# EasyEDA Pro project Soruce.epro, schematic Schematic1

## Sheets
1 P1: Board Name: Board1; Create Date: 2026-04-02; Page Name: P1; Project Name: LED MATRIX; Schematic Name: Schematic1; Update Date: 2026-04-02; Company: EasyEDA.com; Page Size: A4; Version: V1.0
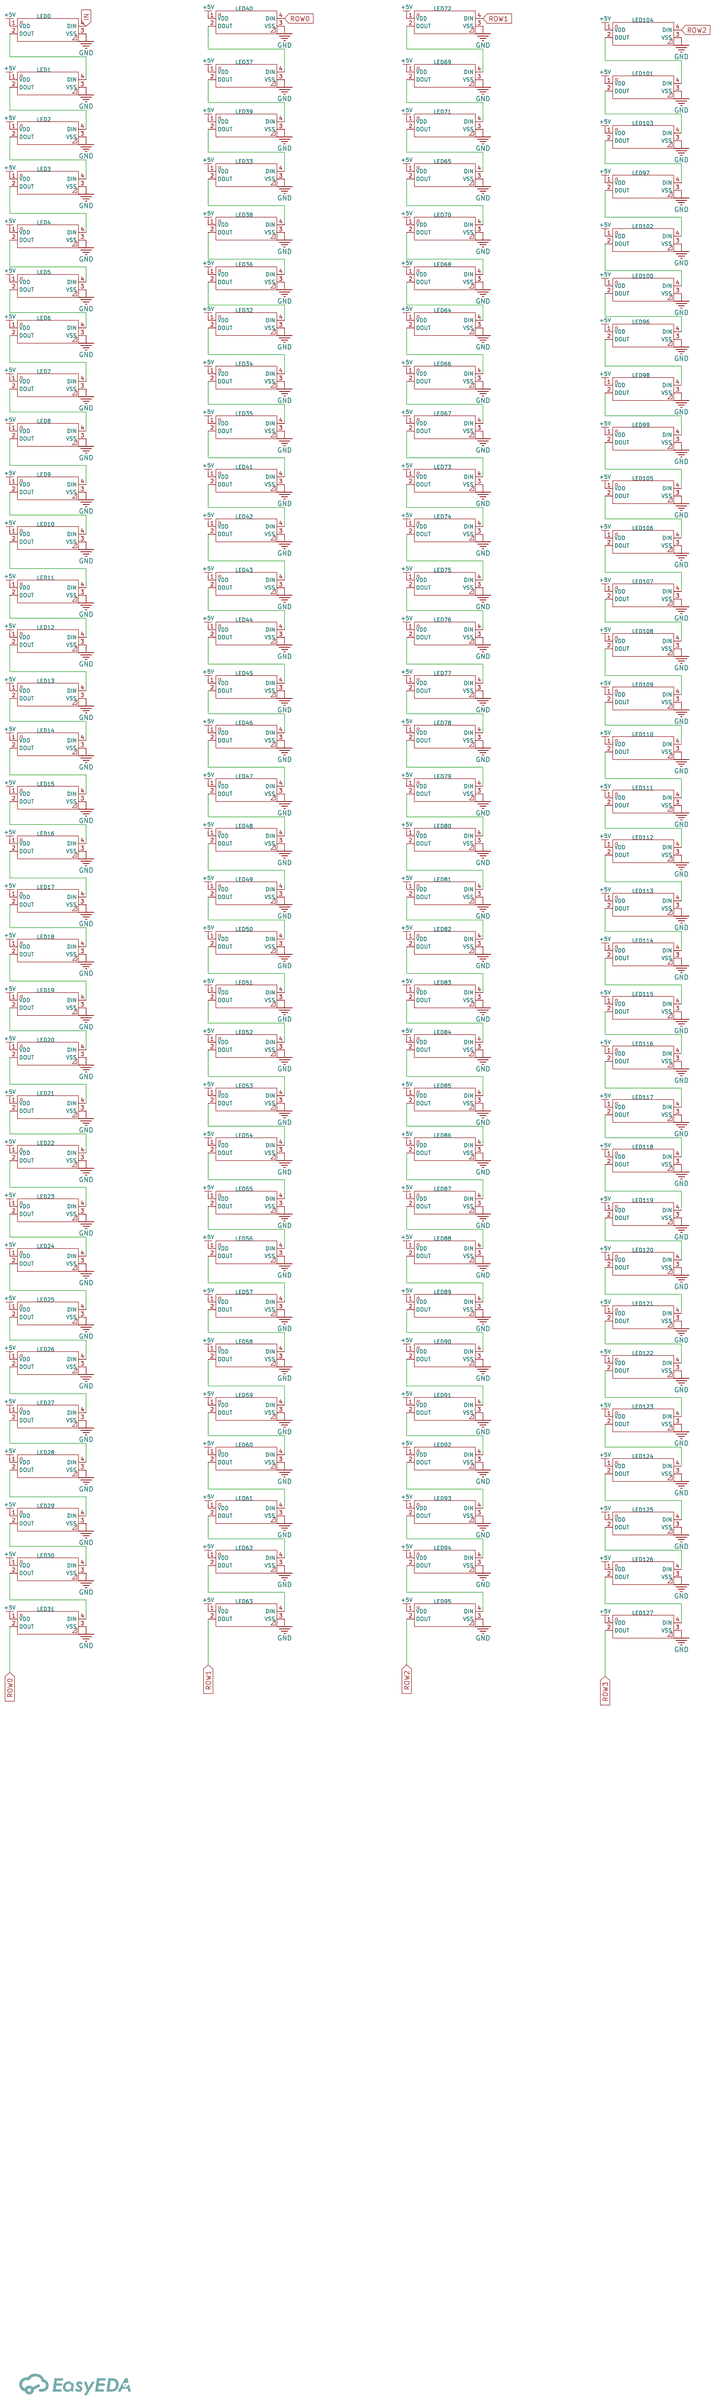
[diagram p0: P1]
2 P2: Page Name: P2
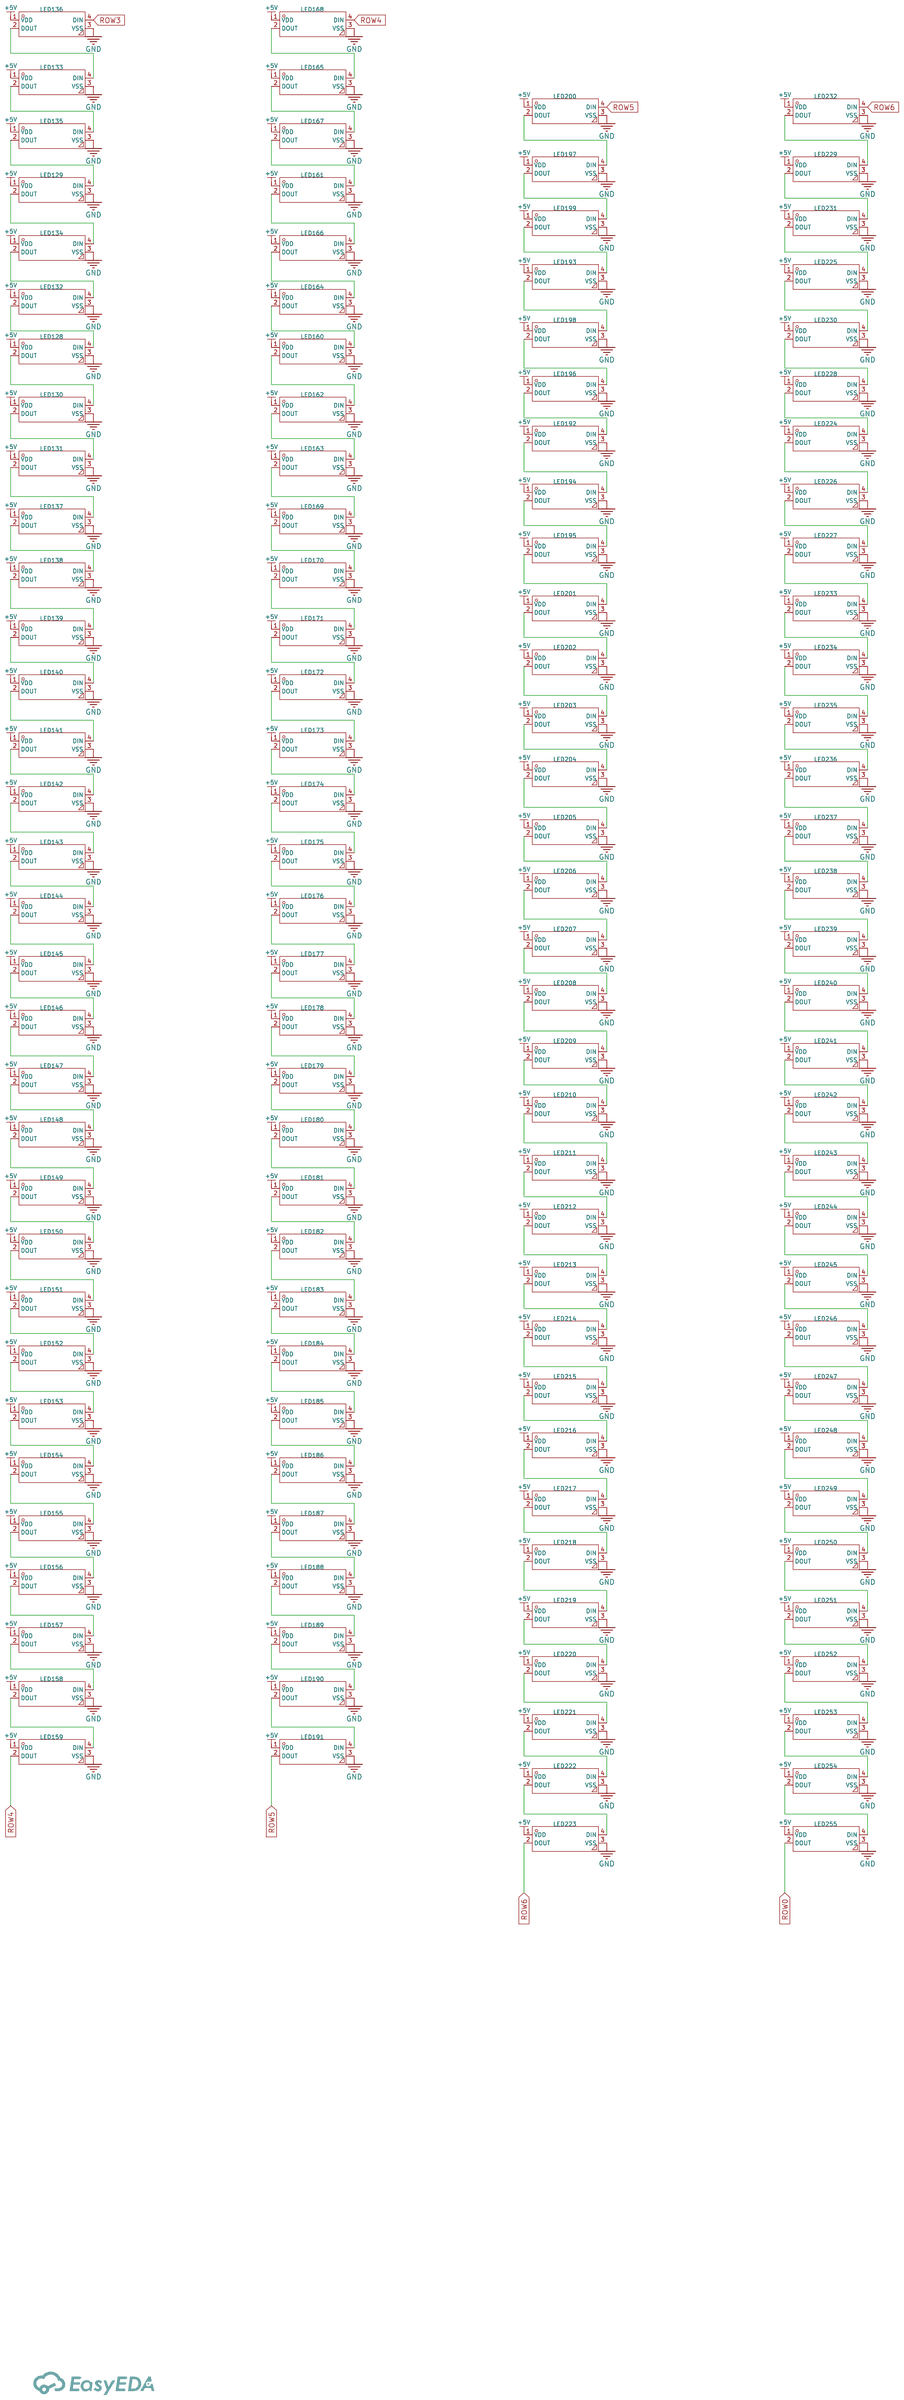
[diagram p1: P2]
3 P3: Page Name: P3
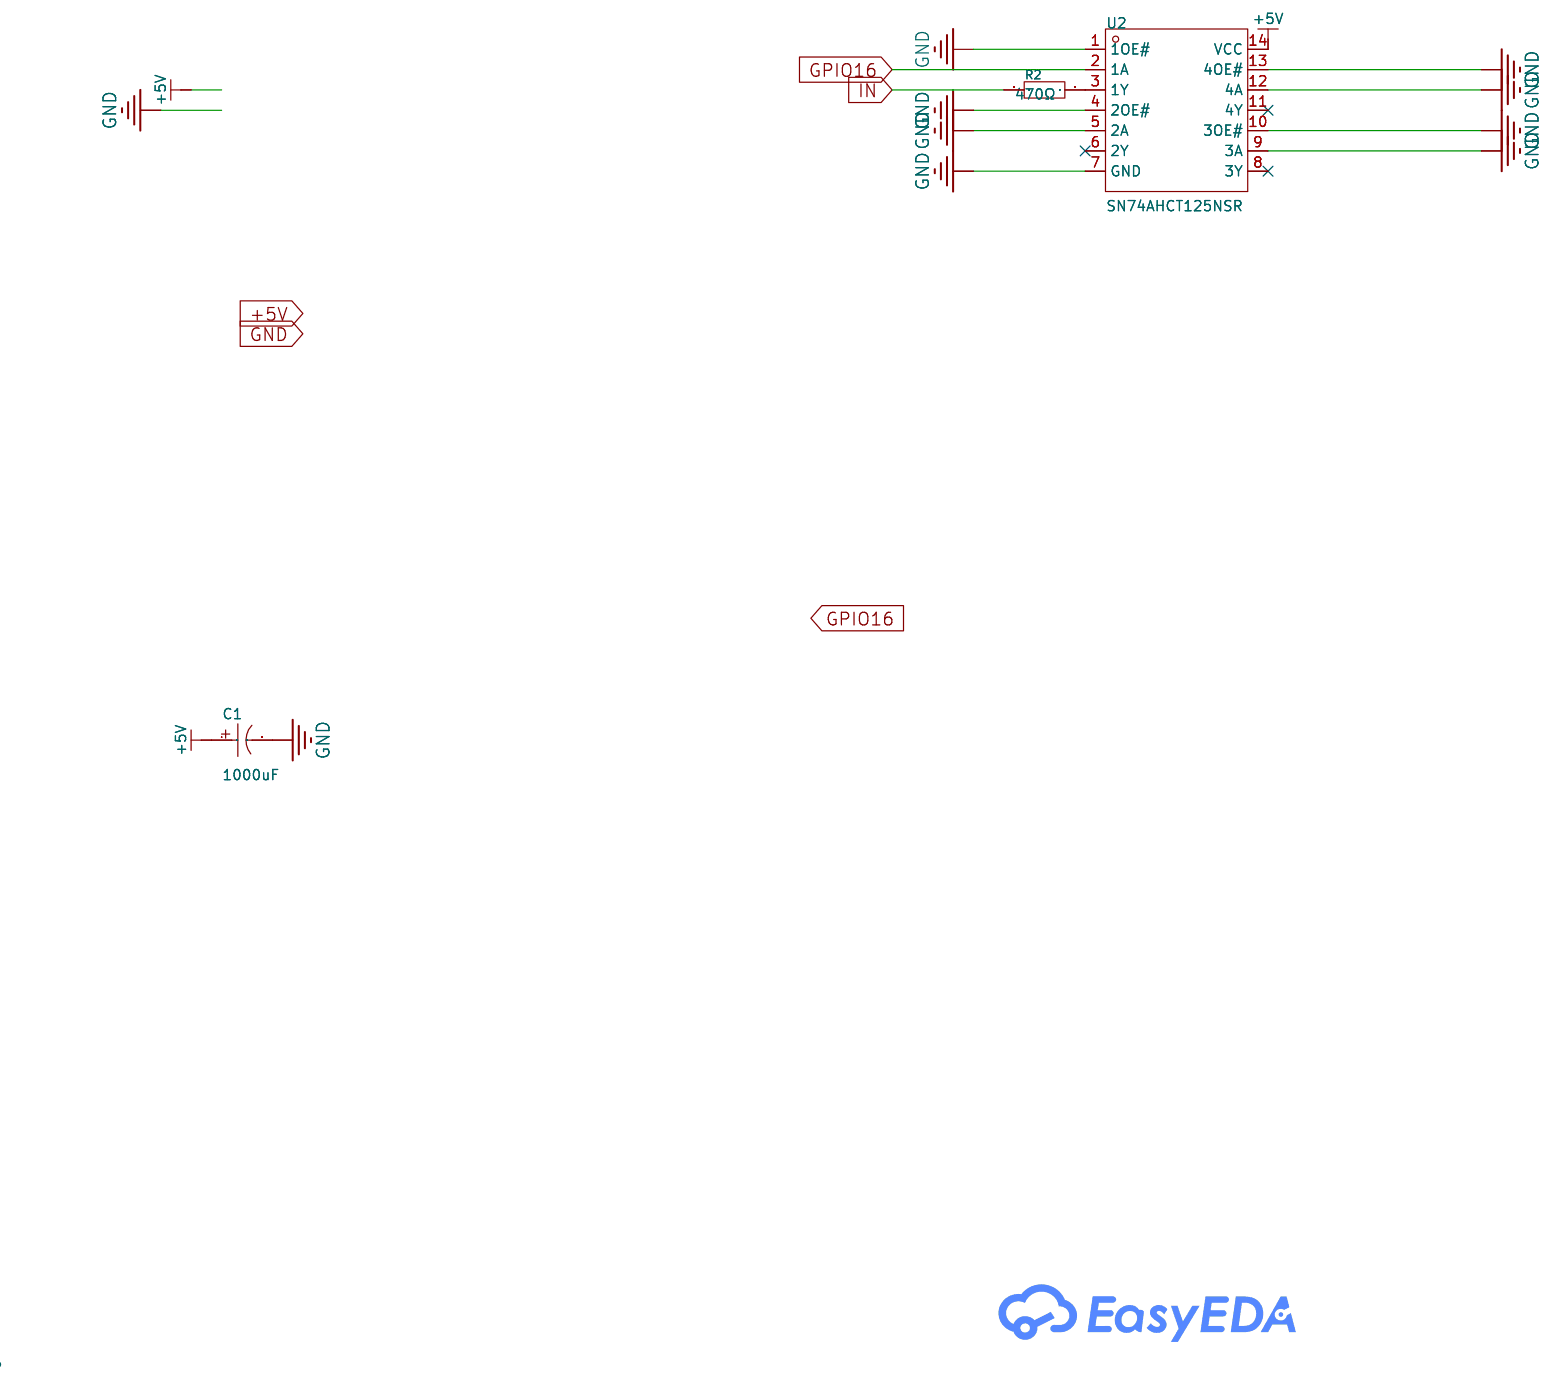
[diagram p2: P3]

## Parts
sheet P1
LED0  WS2812B-B/T  [LED-SMD_4P-L5.0-W5.0-TL_WS2812B-B]
LED1  WS2812B-B/T  [LED-SMD_4P-L5.0-W5.0-TL_WS2812B-B]
LED2  WS2812B-B/T  [LED-SMD_4P-L5.0-W5.0-TL_WS2812B-B]
LED3  WS2812B-B/T  [LED-SMD_4P-L5.0-W5.0-TL_WS2812B-B]
LED4  WS2812B-B/T  [LED-SMD_4P-L5.0-W5.0-TL_WS2812B-B]
LED5  WS2812B-B/T  [LED-SMD_4P-L5.0-W5.0-TL_WS2812B-B]
LED6  WS2812B-B/T  [LED-SMD_4P-L5.0-W5.0-TL_WS2812B-B]
LED7  WS2812B-B/T  [LED-SMD_4P-L5.0-W5.0-TL_WS2812B-B]
LED8  WS2812B-B/T  [LED-SMD_4P-L5.0-W5.0-TL_WS2812B-B]
LED9  WS2812B-B/T  [LED-SMD_4P-L5.0-W5.0-TL_WS2812B-B]
LED10  WS2812B-B/T  [LED-SMD_4P-L5.0-W5.0-TL_WS2812B-B]
LED11  WS2812B-B/T  [LED-SMD_4P-L5.0-W5.0-TL_WS2812B-B]
LED12  WS2812B-B/T  [LED-SMD_4P-L5.0-W5.0-TL_WS2812B-B]
LED13  WS2812B-B/T  [LED-SMD_4P-L5.0-W5.0-TL_WS2812B-B]
LED14  WS2812B-B/T  [LED-SMD_4P-L5.0-W5.0-TL_WS2812B-B]
LED15  WS2812B-B/T  [LED-SMD_4P-L5.0-W5.0-TL_WS2812B-B]
LED16  WS2812B-B/T  [LED-SMD_4P-L5.0-W5.0-TL_WS2812B-B]
LED17  WS2812B-B/T  [LED-SMD_4P-L5.0-W5.0-TL_WS2812B-B]
LED18  WS2812B-B/T  [LED-SMD_4P-L5.0-W5.0-TL_WS2812B-B]
LED19  WS2812B-B/T  [LED-SMD_4P-L5.0-W5.0-TL_WS2812B-B]
LED20  WS2812B-B/T  [LED-SMD_4P-L5.0-W5.0-TL_WS2812B-B]
LED21  WS2812B-B/T  [LED-SMD_4P-L5.0-W5.0-TL_WS2812B-B]
LED22  WS2812B-B/T  [LED-SMD_4P-L5.0-W5.0-TL_WS2812B-B]
LED23  WS2812B-B/T  [LED-SMD_4P-L5.0-W5.0-TL_WS2812B-B]
LED24  WS2812B-B/T  [LED-SMD_4P-L5.0-W5.0-TL_WS2812B-B]
LED25  WS2812B-B/T  [LED-SMD_4P-L5.0-W5.0-TL_WS2812B-B]
LED26  WS2812B-B/T  [LED-SMD_4P-L5.0-W5.0-TL_WS2812B-B]
LED27  WS2812B-B/T  [LED-SMD_4P-L5.0-W5.0-TL_WS2812B-B]
LED28  WS2812B-B/T  [LED-SMD_4P-L5.0-W5.0-TL_WS2812B-B]
LED29  WS2812B-B/T  [LED-SMD_4P-L5.0-W5.0-TL_WS2812B-B]
LED30  WS2812B-B/T  [LED-SMD_4P-L5.0-W5.0-TL_WS2812B-B]
LED31  WS2812B-B/T  [LED-SMD_4P-L5.0-W5.0-TL_WS2812B-B]
LED32  WS2812B-B/T  [LED-SMD_4P-L5.0-W5.0-TL_WS2812B-B]
LED33  WS2812B-B/T  [LED-SMD_4P-L5.0-W5.0-TL_WS2812B-B]
LED34  WS2812B-B/T  [LED-SMD_4P-L5.0-W5.0-TL_WS2812B-B]
LED35  WS2812B-B/T  [LED-SMD_4P-L5.0-W5.0-TL_WS2812B-B]
LED36  WS2812B-B/T  [LED-SMD_4P-L5.0-W5.0-TL_WS2812B-B]
LED37  WS2812B-B/T  [LED-SMD_4P-L5.0-W5.0-TL_WS2812B-B]
LED38  WS2812B-B/T  [LED-SMD_4P-L5.0-W5.0-TL_WS2812B-B]
LED39  WS2812B-B/T  [LED-SMD_4P-L5.0-W5.0-TL_WS2812B-B]
LED40  WS2812B-B/T  [LED-SMD_4P-L5.0-W5.0-TL_WS2812B-B]
LED41  WS2812B-B/T  [LED-SMD_4P-L5.0-W5.0-TL_WS2812B-B]
LED42  WS2812B-B/T  [LED-SMD_4P-L5.0-W5.0-TL_WS2812B-B]
LED43  WS2812B-B/T  [LED-SMD_4P-L5.0-W5.0-TL_WS2812B-B]
LED44  WS2812B-B/T  [LED-SMD_4P-L5.0-W5.0-TL_WS2812B-B]
LED45  WS2812B-B/T  [LED-SMD_4P-L5.0-W5.0-TL_WS2812B-B]
LED46  WS2812B-B/T  [LED-SMD_4P-L5.0-W5.0-TL_WS2812B-B]
LED47  WS2812B-B/T  [LED-SMD_4P-L5.0-W5.0-TL_WS2812B-B]
LED48  WS2812B-B/T  [LED-SMD_4P-L5.0-W5.0-TL_WS2812B-B]
LED49  WS2812B-B/T  [LED-SMD_4P-L5.0-W5.0-TL_WS2812B-B]
LED50  WS2812B-B/T  [LED-SMD_4P-L5.0-W5.0-TL_WS2812B-B]
LED51  WS2812B-B/T  [LED-SMD_4P-L5.0-W5.0-TL_WS2812B-B]
LED52  WS2812B-B/T  [LED-SMD_4P-L5.0-W5.0-TL_WS2812B-B]
LED53  WS2812B-B/T  [LED-SMD_4P-L5.0-W5.0-TL_WS2812B-B]
LED54  WS2812B-B/T  [LED-SMD_4P-L5.0-W5.0-TL_WS2812B-B]
LED55  WS2812B-B/T  [LED-SMD_4P-L5.0-W5.0-TL_WS2812B-B]
LED56  WS2812B-B/T  [LED-SMD_4P-L5.0-W5.0-TL_WS2812B-B]
LED57  WS2812B-B/T  [LED-SMD_4P-L5.0-W5.0-TL_WS2812B-B]
LED58  WS2812B-B/T  [LED-SMD_4P-L5.0-W5.0-TL_WS2812B-B]
LED59  WS2812B-B/T  [LED-SMD_4P-L5.0-W5.0-TL_WS2812B-B]
LED60  WS2812B-B/T  [LED-SMD_4P-L5.0-W5.0-TL_WS2812B-B]
LED61  WS2812B-B/T  [LED-SMD_4P-L5.0-W5.0-TL_WS2812B-B]
LED62  WS2812B-B/T  [LED-SMD_4P-L5.0-W5.0-TL_WS2812B-B]
LED63  WS2812B-B/T  [LED-SMD_4P-L5.0-W5.0-TL_WS2812B-B]
LED64  WS2812B-B/T  [LED-SMD_4P-L5.0-W5.0-TL_WS2812B-B]
LED65  WS2812B-B/T  [LED-SMD_4P-L5.0-W5.0-TL_WS2812B-B]
LED66  WS2812B-B/T  [LED-SMD_4P-L5.0-W5.0-TL_WS2812B-B]
LED67  WS2812B-B/T  [LED-SMD_4P-L5.0-W5.0-TL_WS2812B-B]
LED68  WS2812B-B/T  [LED-SMD_4P-L5.0-W5.0-TL_WS2812B-B]
LED69  WS2812B-B/T  [LED-SMD_4P-L5.0-W5.0-TL_WS2812B-B]
LED70  WS2812B-B/T  [LED-SMD_4P-L5.0-W5.0-TL_WS2812B-B]
LED71  WS2812B-B/T  [LED-SMD_4P-L5.0-W5.0-TL_WS2812B-B]
LED72  WS2812B-B/T  [LED-SMD_4P-L5.0-W5.0-TL_WS2812B-B]
LED73  WS2812B-B/T  [LED-SMD_4P-L5.0-W5.0-TL_WS2812B-B]
LED74  WS2812B-B/T  [LED-SMD_4P-L5.0-W5.0-TL_WS2812B-B]
LED75  WS2812B-B/T  [LED-SMD_4P-L5.0-W5.0-TL_WS2812B-B]
LED76  WS2812B-B/T  [LED-SMD_4P-L5.0-W5.0-TL_WS2812B-B]
LED77  WS2812B-B/T  [LED-SMD_4P-L5.0-W5.0-TL_WS2812B-B]
LED78  WS2812B-B/T  [LED-SMD_4P-L5.0-W5.0-TL_WS2812B-B]
LED79  WS2812B-B/T  [LED-SMD_4P-L5.0-W5.0-TL_WS2812B-B]
LED80  WS2812B-B/T  [LED-SMD_4P-L5.0-W5.0-TL_WS2812B-B]
LED81  WS2812B-B/T  [LED-SMD_4P-L5.0-W5.0-TL_WS2812B-B]
LED82  WS2812B-B/T  [LED-SMD_4P-L5.0-W5.0-TL_WS2812B-B]
LED83  WS2812B-B/T  [LED-SMD_4P-L5.0-W5.0-TL_WS2812B-B]
LED84  WS2812B-B/T  [LED-SMD_4P-L5.0-W5.0-TL_WS2812B-B]
LED85  WS2812B-B/T  [LED-SMD_4P-L5.0-W5.0-TL_WS2812B-B]
LED86  WS2812B-B/T  [LED-SMD_4P-L5.0-W5.0-TL_WS2812B-B]
LED87  WS2812B-B/T  [LED-SMD_4P-L5.0-W5.0-TL_WS2812B-B]
LED88  WS2812B-B/T  [LED-SMD_4P-L5.0-W5.0-TL_WS2812B-B]
LED89  WS2812B-B/T  [LED-SMD_4P-L5.0-W5.0-TL_WS2812B-B]
LED90  WS2812B-B/T  [LED-SMD_4P-L5.0-W5.0-TL_WS2812B-B]
LED91  WS2812B-B/T  [LED-SMD_4P-L5.0-W5.0-TL_WS2812B-B]
LED92  WS2812B-B/T  [LED-SMD_4P-L5.0-W5.0-TL_WS2812B-B]
LED93  WS2812B-B/T  [LED-SMD_4P-L5.0-W5.0-TL_WS2812B-B]
LED94  WS2812B-B/T  [LED-SMD_4P-L5.0-W5.0-TL_WS2812B-B]
LED95  WS2812B-B/T  [LED-SMD_4P-L5.0-W5.0-TL_WS2812B-B]
LED96  WS2812B-B/T  [LED-SMD_4P-L5.0-W5.0-TL_WS2812B-B]
LED97  WS2812B-B/T  [LED-SMD_4P-L5.0-W5.0-TL_WS2812B-B]
LED98  WS2812B-B/T  [LED-SMD_4P-L5.0-W5.0-TL_WS2812B-B]
LED99  WS2812B-B/T  [LED-SMD_4P-L5.0-W5.0-TL_WS2812B-B]
LED100  WS2812B-B/T  [LED-SMD_4P-L5.0-W5.0-TL_WS2812B-B]
LED101  WS2812B-B/T  [LED-SMD_4P-L5.0-W5.0-TL_WS2812B-B]
LED102  WS2812B-B/T  [LED-SMD_4P-L5.0-W5.0-TL_WS2812B-B]
LED103  WS2812B-B/T  [LED-SMD_4P-L5.0-W5.0-TL_WS2812B-B]
LED104  WS2812B-B/T  [LED-SMD_4P-L5.0-W5.0-TL_WS2812B-B]
LED105  WS2812B-B/T  [LED-SMD_4P-L5.0-W5.0-TL_WS2812B-B]
LED106  WS2812B-B/T  [LED-SMD_4P-L5.0-W5.0-TL_WS2812B-B]
LED107  WS2812B-B/T  [LED-SMD_4P-L5.0-W5.0-TL_WS2812B-B]
LED108  WS2812B-B/T  [LED-SMD_4P-L5.0-W5.0-TL_WS2812B-B]
LED109  WS2812B-B/T  [LED-SMD_4P-L5.0-W5.0-TL_WS2812B-B]
LED110  WS2812B-B/T  [LED-SMD_4P-L5.0-W5.0-TL_WS2812B-B]
LED111  WS2812B-B/T  [LED-SMD_4P-L5.0-W5.0-TL_WS2812B-B]
LED112  WS2812B-B/T  [LED-SMD_4P-L5.0-W5.0-TL_WS2812B-B]
LED113  WS2812B-B/T  [LED-SMD_4P-L5.0-W5.0-TL_WS2812B-B]
LED114  WS2812B-B/T  [LED-SMD_4P-L5.0-W5.0-TL_WS2812B-B]
LED115  WS2812B-B/T  [LED-SMD_4P-L5.0-W5.0-TL_WS2812B-B]
LED116  WS2812B-B/T  [LED-SMD_4P-L5.0-W5.0-TL_WS2812B-B]
LED117  WS2812B-B/T  [LED-SMD_4P-L5.0-W5.0-TL_WS2812B-B]
LED118  WS2812B-B/T  [LED-SMD_4P-L5.0-W5.0-TL_WS2812B-B]
LED119  WS2812B-B/T  [LED-SMD_4P-L5.0-W5.0-TL_WS2812B-B]
LED120  WS2812B-B/T  [LED-SMD_4P-L5.0-W5.0-TL_WS2812B-B]
LED121  WS2812B-B/T  [LED-SMD_4P-L5.0-W5.0-TL_WS2812B-B]
LED122  WS2812B-B/T  [LED-SMD_4P-L5.0-W5.0-TL_WS2812B-B]
LED123  WS2812B-B/T  [LED-SMD_4P-L5.0-W5.0-TL_WS2812B-B]
LED124  WS2812B-B/T  [LED-SMD_4P-L5.0-W5.0-TL_WS2812B-B]
LED125  WS2812B-B/T  [LED-SMD_4P-L5.0-W5.0-TL_WS2812B-B]
LED126  WS2812B-B/T  [LED-SMD_4P-L5.0-W5.0-TL_WS2812B-B]
LED127  WS2812B-B/T  [LED-SMD_4P-L5.0-W5.0-TL_WS2812B-B]
sheet P2
LED128  WS2812B-B/T  [LED-SMD_4P-L5.0-W5.0-TL_WS2812B-B]
LED129  WS2812B-B/T  [LED-SMD_4P-L5.0-W5.0-TL_WS2812B-B]
LED130  WS2812B-B/T  [LED-SMD_4P-L5.0-W5.0-TL_WS2812B-B]
LED131  WS2812B-B/T  [LED-SMD_4P-L5.0-W5.0-TL_WS2812B-B]
LED132  WS2812B-B/T  [LED-SMD_4P-L5.0-W5.0-TL_WS2812B-B]
LED133  WS2812B-B/T  [LED-SMD_4P-L5.0-W5.0-TL_WS2812B-B]
LED134  WS2812B-B/T  [LED-SMD_4P-L5.0-W5.0-TL_WS2812B-B]
LED135  WS2812B-B/T  [LED-SMD_4P-L5.0-W5.0-TL_WS2812B-B]
LED136  WS2812B-B/T  [LED-SMD_4P-L5.0-W5.0-TL_WS2812B-B]
LED137  WS2812B-B/T  [LED-SMD_4P-L5.0-W5.0-TL_WS2812B-B]
LED138  WS2812B-B/T  [LED-SMD_4P-L5.0-W5.0-TL_WS2812B-B]
LED139  WS2812B-B/T  [LED-SMD_4P-L5.0-W5.0-TL_WS2812B-B]
LED140  WS2812B-B/T  [LED-SMD_4P-L5.0-W5.0-TL_WS2812B-B]
LED141  WS2812B-B/T  [LED-SMD_4P-L5.0-W5.0-TL_WS2812B-B]
LED142  WS2812B-B/T  [LED-SMD_4P-L5.0-W5.0-TL_WS2812B-B]
LED143  WS2812B-B/T  [LED-SMD_4P-L5.0-W5.0-TL_WS2812B-B]
LED144  WS2812B-B/T  [LED-SMD_4P-L5.0-W5.0-TL_WS2812B-B]
LED145  WS2812B-B/T  [LED-SMD_4P-L5.0-W5.0-TL_WS2812B-B]
LED146  WS2812B-B/T  [LED-SMD_4P-L5.0-W5.0-TL_WS2812B-B]
LED147  WS2812B-B/T  [LED-SMD_4P-L5.0-W5.0-TL_WS2812B-B]
LED148  WS2812B-B/T  [LED-SMD_4P-L5.0-W5.0-TL_WS2812B-B]
LED149  WS2812B-B/T  [LED-SMD_4P-L5.0-W5.0-TL_WS2812B-B]
LED150  WS2812B-B/T  [LED-SMD_4P-L5.0-W5.0-TL_WS2812B-B]
LED151  WS2812B-B/T  [LED-SMD_4P-L5.0-W5.0-TL_WS2812B-B]
LED152  WS2812B-B/T  [LED-SMD_4P-L5.0-W5.0-TL_WS2812B-B]
LED153  WS2812B-B/T  [LED-SMD_4P-L5.0-W5.0-TL_WS2812B-B]
LED154  WS2812B-B/T  [LED-SMD_4P-L5.0-W5.0-TL_WS2812B-B]
LED155  WS2812B-B/T  [LED-SMD_4P-L5.0-W5.0-TL_WS2812B-B]
LED156  WS2812B-B/T  [LED-SMD_4P-L5.0-W5.0-TL_WS2812B-B]
LED157  WS2812B-B/T  [LED-SMD_4P-L5.0-W5.0-TL_WS2812B-B]
LED158  WS2812B-B/T  [LED-SMD_4P-L5.0-W5.0-TL_WS2812B-B]
LED159  WS2812B-B/T  [LED-SMD_4P-L5.0-W5.0-TL_WS2812B-B]
LED160  WS2812B-B/T  [LED-SMD_4P-L5.0-W5.0-TL_WS2812B-B]
LED161  WS2812B-B/T  [LED-SMD_4P-L5.0-W5.0-TL_WS2812B-B]
LED162  WS2812B-B/T  [LED-SMD_4P-L5.0-W5.0-TL_WS2812B-B]
LED163  WS2812B-B/T  [LED-SMD_4P-L5.0-W5.0-TL_WS2812B-B]
LED164  WS2812B-B/T  [LED-SMD_4P-L5.0-W5.0-TL_WS2812B-B]
LED165  WS2812B-B/T  [LED-SMD_4P-L5.0-W5.0-TL_WS2812B-B]
LED166  WS2812B-B/T  [LED-SMD_4P-L5.0-W5.0-TL_WS2812B-B]
LED167  WS2812B-B/T  [LED-SMD_4P-L5.0-W5.0-TL_WS2812B-B]
LED168  WS2812B-B/T  [LED-SMD_4P-L5.0-W5.0-TL_WS2812B-B]
LED169  WS2812B-B/T  [LED-SMD_4P-L5.0-W5.0-TL_WS2812B-B]
LED170  WS2812B-B/T  [LED-SMD_4P-L5.0-W5.0-TL_WS2812B-B]
LED171  WS2812B-B/T  [LED-SMD_4P-L5.0-W5.0-TL_WS2812B-B]
LED172  WS2812B-B/T  [LED-SMD_4P-L5.0-W5.0-TL_WS2812B-B]
LED173  WS2812B-B/T  [LED-SMD_4P-L5.0-W5.0-TL_WS2812B-B]
LED174  WS2812B-B/T  [LED-SMD_4P-L5.0-W5.0-TL_WS2812B-B]
LED175  WS2812B-B/T  [LED-SMD_4P-L5.0-W5.0-TL_WS2812B-B]
LED176  WS2812B-B/T  [LED-SMD_4P-L5.0-W5.0-TL_WS2812B-B]
LED177  WS2812B-B/T  [LED-SMD_4P-L5.0-W5.0-TL_WS2812B-B]
LED178  WS2812B-B/T  [LED-SMD_4P-L5.0-W5.0-TL_WS2812B-B]
LED179  WS2812B-B/T  [LED-SMD_4P-L5.0-W5.0-TL_WS2812B-B]
LED180  WS2812B-B/T  [LED-SMD_4P-L5.0-W5.0-TL_WS2812B-B]
LED181  WS2812B-B/T  [LED-SMD_4P-L5.0-W5.0-TL_WS2812B-B]
LED182  WS2812B-B/T  [LED-SMD_4P-L5.0-W5.0-TL_WS2812B-B]
LED183  WS2812B-B/T  [LED-SMD_4P-L5.0-W5.0-TL_WS2812B-B]
LED184  WS2812B-B/T  [LED-SMD_4P-L5.0-W5.0-TL_WS2812B-B]
LED185  WS2812B-B/T  [LED-SMD_4P-L5.0-W5.0-TL_WS2812B-B]
LED186  WS2812B-B/T  [LED-SMD_4P-L5.0-W5.0-TL_WS2812B-B]
LED187  WS2812B-B/T  [LED-SMD_4P-L5.0-W5.0-TL_WS2812B-B]
LED188  WS2812B-B/T  [LED-SMD_4P-L5.0-W5.0-TL_WS2812B-B]
LED189  WS2812B-B/T  [LED-SMD_4P-L5.0-W5.0-TL_WS2812B-B]
LED190  WS2812B-B/T  [LED-SMD_4P-L5.0-W5.0-TL_WS2812B-B]
LED191  WS2812B-B/T  [LED-SMD_4P-L5.0-W5.0-TL_WS2812B-B]
LED192  WS2812B-B/T  [LED-SMD_4P-L5.0-W5.0-TL_WS2812B-B]
LED193  WS2812B-B/T  [LED-SMD_4P-L5.0-W5.0-TL_WS2812B-B]
LED194  WS2812B-B/T  [LED-SMD_4P-L5.0-W5.0-TL_WS2812B-B]
LED195  WS2812B-B/T  [LED-SMD_4P-L5.0-W5.0-TL_WS2812B-B]
LED196  WS2812B-B/T  [LED-SMD_4P-L5.0-W5.0-TL_WS2812B-B]
LED197  WS2812B-B/T  [LED-SMD_4P-L5.0-W5.0-TL_WS2812B-B]
LED198  WS2812B-B/T  [LED-SMD_4P-L5.0-W5.0-TL_WS2812B-B]
LED199  WS2812B-B/T  [LED-SMD_4P-L5.0-W5.0-TL_WS2812B-B]
LED200  WS2812B-B/T  [LED-SMD_4P-L5.0-W5.0-TL_WS2812B-B]
LED201  WS2812B-B/T  [LED-SMD_4P-L5.0-W5.0-TL_WS2812B-B]
LED202  WS2812B-B/T  [LED-SMD_4P-L5.0-W5.0-TL_WS2812B-B]
LED203  WS2812B-B/T  [LED-SMD_4P-L5.0-W5.0-TL_WS2812B-B]
LED204  WS2812B-B/T  [LED-SMD_4P-L5.0-W5.0-TL_WS2812B-B]
LED205  WS2812B-B/T  [LED-SMD_4P-L5.0-W5.0-TL_WS2812B-B]
LED206  WS2812B-B/T  [LED-SMD_4P-L5.0-W5.0-TL_WS2812B-B]
LED207  WS2812B-B/T  [LED-SMD_4P-L5.0-W5.0-TL_WS2812B-B]
LED208  WS2812B-B/T  [LED-SMD_4P-L5.0-W5.0-TL_WS2812B-B]
LED209  WS2812B-B/T  [LED-SMD_4P-L5.0-W5.0-TL_WS2812B-B]
LED210  WS2812B-B/T  [LED-SMD_4P-L5.0-W5.0-TL_WS2812B-B]
LED211  WS2812B-B/T  [LED-SMD_4P-L5.0-W5.0-TL_WS2812B-B]
LED212  WS2812B-B/T  [LED-SMD_4P-L5.0-W5.0-TL_WS2812B-B]
LED213  WS2812B-B/T  [LED-SMD_4P-L5.0-W5.0-TL_WS2812B-B]
LED214  WS2812B-B/T  [LED-SMD_4P-L5.0-W5.0-TL_WS2812B-B]
LED215  WS2812B-B/T  [LED-SMD_4P-L5.0-W5.0-TL_WS2812B-B]
LED216  WS2812B-B/T  [LED-SMD_4P-L5.0-W5.0-TL_WS2812B-B]
LED217  WS2812B-B/T  [LED-SMD_4P-L5.0-W5.0-TL_WS2812B-B]
LED218  WS2812B-B/T  [LED-SMD_4P-L5.0-W5.0-TL_WS2812B-B]
LED219  WS2812B-B/T  [LED-SMD_4P-L5.0-W5.0-TL_WS2812B-B]
LED220  WS2812B-B/T  [LED-SMD_4P-L5.0-W5.0-TL_WS2812B-B]
LED221  WS2812B-B/T  [LED-SMD_4P-L5.0-W5.0-TL_WS2812B-B]
LED222  WS2812B-B/T  [LED-SMD_4P-L5.0-W5.0-TL_WS2812B-B]
LED223  WS2812B-B/T  [LED-SMD_4P-L5.0-W5.0-TL_WS2812B-B]
LED224  WS2812B-B/T  [LED-SMD_4P-L5.0-W5.0-TL_WS2812B-B]
LED225  WS2812B-B/T  [LED-SMD_4P-L5.0-W5.0-TL_WS2812B-B]
LED226  WS2812B-B/T  [LED-SMD_4P-L5.0-W5.0-TL_WS2812B-B]
LED227  WS2812B-B/T  [LED-SMD_4P-L5.0-W5.0-TL_WS2812B-B]
LED228  WS2812B-B/T  [LED-SMD_4P-L5.0-W5.0-TL_WS2812B-B]
LED229  WS2812B-B/T  [LED-SMD_4P-L5.0-W5.0-TL_WS2812B-B]
LED230  WS2812B-B/T  [LED-SMD_4P-L5.0-W5.0-TL_WS2812B-B]
LED231  WS2812B-B/T  [LED-SMD_4P-L5.0-W5.0-TL_WS2812B-B]
LED232  WS2812B-B/T  [LED-SMD_4P-L5.0-W5.0-TL_WS2812B-B]
LED233  WS2812B-B/T  [LED-SMD_4P-L5.0-W5.0-TL_WS2812B-B]
LED234  WS2812B-B/T  [LED-SMD_4P-L5.0-W5.0-TL_WS2812B-B]
LED235  WS2812B-B/T  [LED-SMD_4P-L5.0-W5.0-TL_WS2812B-B]
LED236  WS2812B-B/T  [LED-SMD_4P-L5.0-W5.0-TL_WS2812B-B]
LED237  WS2812B-B/T  [LED-SMD_4P-L5.0-W5.0-TL_WS2812B-B]
LED238  WS2812B-B/T  [LED-SMD_4P-L5.0-W5.0-TL_WS2812B-B]
LED239  WS2812B-B/T  [LED-SMD_4P-L5.0-W5.0-TL_WS2812B-B]
LED240  WS2812B-B/T  [LED-SMD_4P-L5.0-W5.0-TL_WS2812B-B]
LED241  WS2812B-B/T  [LED-SMD_4P-L5.0-W5.0-TL_WS2812B-B]
LED242  WS2812B-B/T  [LED-SMD_4P-L5.0-W5.0-TL_WS2812B-B]
LED243  WS2812B-B/T  [LED-SMD_4P-L5.0-W5.0-TL_WS2812B-B]
LED244  WS2812B-B/T  [LED-SMD_4P-L5.0-W5.0-TL_WS2812B-B]
LED245  WS2812B-B/T  [LED-SMD_4P-L5.0-W5.0-TL_WS2812B-B]
LED246  WS2812B-B/T  [LED-SMD_4P-L5.0-W5.0-TL_WS2812B-B]
LED247  WS2812B-B/T  [LED-SMD_4P-L5.0-W5.0-TL_WS2812B-B]
LED248  WS2812B-B/T  [LED-SMD_4P-L5.0-W5.0-TL_WS2812B-B]
LED249  WS2812B-B/T  [LED-SMD_4P-L5.0-W5.0-TL_WS2812B-B]
LED250  WS2812B-B/T  [LED-SMD_4P-L5.0-W5.0-TL_WS2812B-B]
LED251  WS2812B-B/T  [LED-SMD_4P-L5.0-W5.0-TL_WS2812B-B]
LED252  WS2812B-B/T  [LED-SMD_4P-L5.0-W5.0-TL_WS2812B-B]
LED253  WS2812B-B/T  [LED-SMD_4P-L5.0-W5.0-TL_WS2812B-B]
LED254  WS2812B-B/T  [LED-SMD_4P-L5.0-W5.0-TL_WS2812B-B]
LED255  WS2812B-B/T  [LED-SMD_4P-L5.0-W5.0-TL_WS2812B-B]
sheet P3
C1  1000uF  [CAP-SMD_BD10.0-L10.3-W10.3-LS11.3-FD]
R2  470Ω  [R0805]
U2  SN74AHCT125NSR  [SOP-14_L10.2-W5.3-P1.27-LS7.8-BL]

## Library data of the parts
LED0-LED255 = WS2812B-B/T: Wavelength:520nm；471nm；621nm Luminous Intensity:R:300mcd~500mcd；B:200mcd~300mcd；G:600mcd~1000mcd Fixed-Frequency Pwm Mode:2kHz Data Transmission Rate:800Kbit/s Voltage - Supply:- Voltage - Supply:- Quiescent Current:0.6mA Lens Color:- Peak Wavelength:G:52; LCSC Part Name: RGB三色; Supplier Part: C2761795; Manufacturer: worldsemi; Supplier Footprint: SMD5050-4P; Datasheet: https://item.szlcsc.com/datasheet/WS2812B-B%252FT/2886707.html; Supplier: LCSC; Wavelength: 520nm；471nm；621nm; Luminous Intensity: R:300mcd~500mcd；B:200mcd~300mcd；G:600mcd~1000mcd; Fixed-Frequency Pwm Mode: 2kHz; Data Transmission Rate: 800Kbit/s; Quiescent Current: 0.6mA; Peak Wavelength: G:520nm；R:621nm；B:471nm; Length: 5mm; Width: 1.57mm; Height: 5.4mm
C1 = RVT1C102M1010_C72470: Capacitance:1000uF Tolerance:±20% Tolerance:±20% Voltage Rating:16V Ripple Current:347mA@120Hz Equivalent Series Resistance(ESR):- Diameter:10mm Height - Seated (Max):10.2mm Lifetime:2000hrs@105℃ Operating Temperature:-40℃~+105℃ Operating Temperature:-40℃; LCSC Part Name: 1000uF ±20% 16V; Supplier Part: C72470; Manufacturer: ROQANG(容强); Manufacturer Part: RVT1C102M1010; Supplier Footprint: SMD,D10xL10.2mm; Datasheet: https://item.szlcsc.com/datasheet/RVT1C102M1010/73581.html; Supplier: LCSC; Tolerance: ±20%; Voltage Rating: 16V; Ripple Current: 347mA@120Hz; Diameter: 10mm; Height - Seated (Max): 10.2mm; Lifetime: 2000hrs@105℃; Operating Temperature: -40℃~+105℃
R2 = 0805W8F4700T5E: Type:Thick Film Resistor Resistance:470Ω Tolerance:±1% Tolerance:±1% Power(Watts):125mW Voltage-Supply(Max):150V Temperature Coefficient:±100ppm/℃ Temperature Coefficient:±100ppm/℃ Operating Temperature:-55℃~+155℃ Operating Temperature:-55℃~+155℃; LCSC Part Name: 470Ω ±1% 125mW 厚膜电阻; Supplier Part: C17710; Manufacturer: UNI-ROYAL(厚声); Supplier Footprint: 0805; JLCPCB Part Class: Basic Part; Datasheet: https://item.szlcsc.com/datasheet/0805W8F4700T5E/18398.html; Supplier: LCSC; Type: Thick Film Resistor; Tolerance: ±1%; Power(Watts): 125mW; Voltage-Supply(Max): 150V; Temperature Coefficient: ±100ppm/℃; Operating Temperature: -55℃~+155℃
U2 = SN74AHCT125NSR: Input type:- output type:Tri-State Voltage - Supply:4.5V~5.5V Voltage - Supply:4.5V~5.5V Number of Elements:4 Number of Bits per Element:- Channel Type:Unidirectional Current - Output Low(IOL):8mA Current - Output High(IOH):8mA Logic Family:74AHCT Operati; LCSC Part Name: 三态输出，四路总线缓冲门; Supplier Part: C2675672; Manufacturer: TI(德州仪器); Supplier Footprint: SOP-14-208mil; JLCPCB Part Class: Extended Part; Datasheet: https://www.ti.com/cn/lit/gpn/sn74ahct125; Supplier: LCSC; output type: Tri-State; Voltage - Supply: 4.5V~5.5V; Number of Elements: 4; Channel Type: Unidirectional; Current - Output Low(IOL): 8mA; Current - Output High(IOH): 8mA; Logic Family: 74AHCT; Operating Temperature: -40℃~+85℃; Quiescent Current: 20uA; Propagation Delay: 7.5ns@5V,50pF

## Nets
+5V: C1.1 LED0.1(VDD) LED1.1(VDD) LED2.1(VDD) LED3.1(VDD) LED4.1(VDD) LED5.1(VDD) LED6.1(VDD) LED7.1(VDD) LED8.1(VDD) LED9.1(VDD) LED10.1(VDD) LED11.1(VDD) LED12.1(VDD) LED13.1(VDD) LED14.1(VDD) LED15.1(VDD) LED16.1(VDD) LED17.1(VDD) LED18.1(VDD) LED19.1(VDD) LED20.1(VDD) LED21.1(VDD) LED22.1(VDD) LED23.1(VDD) LED24.1(VDD) LED25.1(VDD) LED26.1(VDD) LED27.1(VDD) LED28.1(VDD) LED29.1(VDD) LED30.1(VDD) LED31.1(VDD) LED32.1(VDD) LED33.1(VDD) LED34.1(VDD) LED35.1(VDD) LED36.1(VDD) LED37.1(VDD) LED38.1(VDD) LED39.1(VDD) LED40.1(VDD) LED41.1(VDD) LED42.1(VDD) LED43.1(VDD) LED44.1(VDD) LED45.1(VDD) LED46.1(VDD) LED47.1(VDD) LED48.1(VDD) LED49.1(VDD) LED50.1(VDD) LED51.1(VDD) LED52.1(VDD) LED53.1(VDD) LED54.1(VDD) LED55.1(VDD) LED56.1(VDD) LED57.1(VDD) LED58.1(VDD) LED59.1(VDD) LED60.1(VDD) LED61.1(VDD) LED62.1(VDD) LED63.1(VDD) LED64.1(VDD) LED65.1(VDD) LED66.1(VDD) LED67.1(VDD) LED68.1(VDD) LED69.1(VDD) LED70.1(VDD) LED71.1(VDD) LED72.1(VDD) LED73.1(VDD) LED74.1(VDD) LED75.1(VDD) LED76.1(VDD) LED77.1(VDD) LED78.1(VDD) LED79.1(VDD) LED80.1(VDD) LED81.1(VDD) LED82.1(VDD) LED83.1(VDD) LED84.1(VDD) LED85.1(VDD) LED86.1(VDD) LED87.1(VDD) LED88.1(VDD) LED89.1(VDD) LED90.1(VDD) LED91.1(VDD) LED92.1(VDD) LED93.1(VDD) LED94.1(VDD) LED95.1(VDD) LED96.1(VDD) LED97.1(VDD) LED98.1(VDD) LED99.1(VDD) LED100.1(VDD) LED101.1(VDD) LED102.1(VDD) LED103.1(VDD) LED104.1(VDD) LED105.1(VDD) LED106.1(VDD) LED107.1(VDD) LED108.1(VDD) LED109.1(VDD) LED110.1(VDD) LED111.1(VDD) LED112.1(VDD) LED113.1(VDD) LED114.1(VDD) LED115.1(VDD) LED116.1(VDD) LED117.1(VDD) LED118.1(VDD) LED119.1(VDD) LED120.1(VDD) LED121.1(VDD) LED122.1(VDD) LED123.1(VDD) LED124.1(VDD) LED125.1(VDD) LED126.1(VDD) LED127.1(VDD) LED128.1(VDD) LED129.1(VDD) LED130.1(VDD) LED131.1(VDD) LED132.1(VDD) LED133.1(VDD) LED134.1(VDD) LED135.1(VDD) LED136.1(VDD) LED137.1(VDD) LED138.1(VDD) LED139.1(VDD) LED140.1(VDD) LED141.1(VDD) LED142.1(VDD) LED143.1(VDD) LED144.1(VDD) LED145.1(VDD) LED146.1(VDD) LED147.1(VDD) LED148.1(VDD) LED149.1(VDD) LED150.1(VDD) LED151.1(VDD) LED152.1(VDD) LED153.1(VDD) LED154.1(VDD) LED155.1(VDD) LED156.1(VDD) LED157.1(VDD) LED158.1(VDD) LED159.1(VDD) LED160.1(VDD) LED161.1(VDD) LED162.1(VDD) LED163.1(VDD) LED164.1(VDD) LED165.1(VDD) LED166.1(VDD) LED167.1(VDD) LED168.1(VDD) LED169.1(VDD) LED170.1(VDD) LED171.1(VDD) LED172.1(VDD) LED173.1(VDD) LED174.1(VDD) LED175.1(VDD) LED176.1(VDD) LED177.1(VDD) LED178.1(VDD) LED179.1(VDD) LED180.1(VDD) LED181.1(VDD) LED182.1(VDD) LED183.1(VDD) LED184.1(VDD) LED185.1(VDD) LED186.1(VDD) LED187.1(VDD) LED188.1(VDD) LED189.1(VDD) LED190.1(VDD) LED191.1(VDD) LED192.1(VDD) LED193.1(VDD) LED194.1(VDD) LED195.1(VDD) LED196.1(VDD) LED197.1(VDD) LED198.1(VDD) LED199.1(VDD) LED200.1(VDD) LED201.1(VDD) LED202.1(VDD) LED203.1(VDD) LED204.1(VDD) LED205.1(VDD) LED206.1(VDD) LED207.1(VDD) LED208.1(VDD) LED209.1(VDD) LED210.1(VDD) LED211.1(VDD) LED212.1(VDD) LED213.1(VDD) LED214.1(VDD) LED215.1(VDD) LED216.1(VDD) LED217.1(VDD) LED218.1(VDD) LED219.1(VDD) LED220.1(VDD) LED221.1(VDD) LED222.1(VDD) LED223.1(VDD) LED224.1(VDD) LED225.1(VDD) LED226.1(VDD) LED227.1(VDD) LED228.1(VDD) LED229.1(VDD) LED230.1(VDD) LED231.1(VDD) LED232.1(VDD) LED233.1(VDD) LED234.1(VDD) LED235.1(VDD) LED236.1(VDD) LED237.1(VDD) LED238.1(VDD) LED239.1(VDD) LED240.1(VDD) LED241.1(VDD) LED242.1(VDD) LED243.1(VDD) LED244.1(VDD) LED245.1(VDD) LED246.1(VDD) LED247.1(VDD) LED248.1(VDD) LED249.1(VDD) LED250.1(VDD) LED251.1(VDD) LED252.1(VDD) LED253.1(VDD) LED254.1(VDD) LED255.1(VDD) U2.14(VCC)
GND: C1.2 LED0.3(VSS) LED1.3(VSS) LED2.3(VSS) LED3.3(VSS) LED4.3(VSS) LED5.3(VSS) LED6.3(VSS) LED7.3(VSS) LED8.3(VSS) LED9.3(VSS) LED10.3(VSS) LED11.3(VSS) LED12.3(VSS) LED13.3(VSS) LED14.3(VSS) LED15.3(VSS) LED16.3(VSS) LED17.3(VSS) LED18.3(VSS) LED19.3(VSS) LED20.3(VSS) LED21.3(VSS) LED22.3(VSS) LED23.3(VSS) LED24.3(VSS) LED25.3(VSS) LED26.3(VSS) LED27.3(VSS) LED28.3(VSS) LED29.3(VSS) LED30.3(VSS) LED31.3(VSS) LED32.3(VSS) LED33.3(VSS) LED34.3(VSS) LED35.3(VSS) LED36.3(VSS) LED37.3(VSS) LED38.3(VSS) LED39.3(VSS) LED40.3(VSS) LED41.3(VSS) LED42.3(VSS) LED43.3(VSS) LED44.3(VSS) LED45.3(VSS) LED46.3(VSS) LED47.3(VSS) LED48.3(VSS) LED49.3(VSS) LED50.3(VSS) LED51.3(VSS) LED52.3(VSS) LED53.3(VSS) LED54.3(VSS) LED55.3(VSS) LED56.3(VSS) LED57.3(VSS) LED58.3(VSS) LED59.3(VSS) LED60.3(VSS) LED61.3(VSS) LED62.3(VSS) LED63.3(VSS) LED64.3(VSS) LED65.3(VSS) LED66.3(VSS) LED67.3(VSS) LED68.3(VSS) LED69.3(VSS) LED70.3(VSS) LED71.3(VSS) LED72.3(VSS) LED73.3(VSS) LED74.3(VSS) LED75.3(VSS) LED76.3(VSS) LED77.3(VSS) LED78.3(VSS) LED79.3(VSS) LED80.3(VSS) LED81.3(VSS) LED82.3(VSS) LED83.3(VSS) LED84.3(VSS) LED85.3(VSS) LED86.3(VSS) LED87.3(VSS) LED88.3(VSS) LED89.3(VSS) LED90.3(VSS) LED91.3(VSS) LED92.3(VSS) LED93.3(VSS) LED94.3(VSS) LED95.3(VSS) LED96.3(VSS) LED97.3(VSS) LED98.3(VSS) LED99.3(VSS) LED100.3(VSS) LED101.3(VSS) LED102.3(VSS) LED103.3(VSS) LED104.3(VSS) LED105.3(VSS) LED106.3(VSS) LED107.3(VSS) LED108.3(VSS) LED109.3(VSS) LED110.3(VSS) LED111.3(VSS) LED112.3(VSS) LED113.3(VSS) LED114.3(VSS) LED115.3(VSS) LED116.3(VSS) LED117.3(VSS) LED118.3(VSS) LED119.3(VSS) LED120.3(VSS) LED121.3(VSS) LED122.3(VSS) LED123.3(VSS) LED124.3(VSS) LED125.3(VSS) LED126.3(VSS) LED127.3(VSS) LED128.3(VSS) LED129.3(VSS) LED130.3(VSS) LED131.3(VSS) LED132.3(VSS) LED133.3(VSS) LED134.3(VSS) LED135.3(VSS) LED136.3(VSS) LED137.3(VSS) LED138.3(VSS) LED139.3(VSS) LED140.3(VSS) LED141.3(VSS) LED142.3(VSS) LED143.3(VSS) LED144.3(VSS) LED145.3(VSS) LED146.3(VSS) LED147.3(VSS) LED148.3(VSS) LED149.3(VSS) LED150.3(VSS) LED151.3(VSS) LED152.3(VSS) LED153.3(VSS) LED154.3(VSS) LED155.3(VSS) LED156.3(VSS) LED157.3(VSS) LED158.3(VSS) LED159.3(VSS) LED160.3(VSS) LED161.3(VSS) LED162.3(VSS) LED163.3(VSS) LED164.3(VSS) LED165.3(VSS) LED166.3(VSS) LED167.3(VSS) LED168.3(VSS) LED169.3(VSS) LED170.3(VSS) LED171.3(VSS) LED172.3(VSS) LED173.3(VSS) LED174.3(VSS) LED175.3(VSS) LED176.3(VSS) LED177.3(VSS) LED178.3(VSS) LED179.3(VSS) LED180.3(VSS) LED181.3(VSS) LED182.3(VSS) LED183.3(VSS) LED184.3(VSS) LED185.3(VSS) LED186.3(VSS) LED187.3(VSS) LED188.3(VSS) LED189.3(VSS) LED190.3(VSS) LED191.3(VSS) LED192.3(VSS) LED193.3(VSS) LED194.3(VSS) LED195.3(VSS) LED196.3(VSS) LED197.3(VSS) LED198.3(VSS) LED199.3(VSS) LED200.3(VSS) LED201.3(VSS) LED202.3(VSS) LED203.3(VSS) LED204.3(VSS) LED205.3(VSS) LED206.3(VSS) LED207.3(VSS) LED208.3(VSS) LED209.3(VSS) LED210.3(VSS) LED211.3(VSS) LED212.3(VSS) LED213.3(VSS) LED214.3(VSS) LED215.3(VSS) LED216.3(VSS) LED217.3(VSS) LED218.3(VSS) LED219.3(VSS) LED220.3(VSS) LED221.3(VSS) LED222.3(VSS) LED223.3(VSS) LED224.3(VSS) LED225.3(VSS) LED226.3(VSS) LED227.3(VSS) LED228.3(VSS) LED229.3(VSS) LED230.3(VSS) LED231.3(VSS) LED232.3(VSS) LED233.3(VSS) LED234.3(VSS) LED235.3(VSS) LED236.3(VSS) LED237.3(VSS) LED238.3(VSS) LED239.3(VSS) LED240.3(VSS) LED241.3(VSS) LED242.3(VSS) LED243.3(VSS) LED244.3(VSS) LED245.3(VSS) LED246.3(VSS) LED247.3(VSS) LED248.3(VSS) LED249.3(VSS) LED250.3(VSS) LED251.3(VSS) LED252.3(VSS) LED253.3(VSS) LED254.3(VSS) LED255.3(VSS) U2.1(1OE#) U2.4(2OE#) U2.5(2A) U2.7(GND) U2.9(3A) U2.10(3OE#) U2.12(4A) U2.13(4OE#)
GPIO16: U2.2(1A)
IN: LED0.4(DIN) R2.2
ROW0: LED31.2(DOUT) LED40.4(DIN) LED255.2(DOUT)
ROW1: LED63.2(DOUT) LED72.4(DIN)
ROW2: LED95.2(DOUT) LED104.4(DIN)
ROW3: LED127.2(DOUT) LED136.4(DIN)
ROW4: LED159.2(DOUT) LED168.4(DIN)
ROW5: LED191.2(DOUT) LED200.4(DIN)
ROW6: LED223.2(DOUT) LED232.4(DIN)
$1N3198: LED0.2(DOUT) LED1.4(DIN)
$1N3202: LED1.2(DOUT) LED2.4(DIN)
$1N3208: LED2.2(DOUT) LED3.4(DIN)
$1N3216: LED3.2(DOUT) LED4.4(DIN)
$1N3234: LED5.2(DOUT) LED6.4(DIN)
$1N3244: LED6.2(DOUT) LED7.4(DIN)
$1N3254: LED4.2(DOUT) LED5.4(DIN)
$1N3258: LED7.2(DOUT) LED8.4(DIN)
$1N3430: LED9.2(DOUT) LED10.4(DIN)
$1N3438: LED8.2(DOUT) LED9.4(DIN)
$1N3594: LED11.2(DOUT) LED12.4(DIN)
$1N3602: LED10.2(DOUT) LED11.4(DIN)
$1N3758: LED13.2(DOUT) LED14.4(DIN)
$1N3766: LED12.2(DOUT) LED13.4(DIN)
$1N3922: LED15.2(DOUT) LED16.4(DIN)
$1N3930: LED14.2(DOUT) LED15.4(DIN)
$1N4086: LED17.2(DOUT) LED18.4(DIN)
$1N4094: LED16.2(DOUT) LED17.4(DIN)
$1N4250: LED19.2(DOUT) LED20.4(DIN)
$1N4258: LED18.2(DOUT) LED19.4(DIN)
$1N4414: LED21.2(DOUT) LED22.4(DIN)
$1N4422: LED20.2(DOUT) LED21.4(DIN)
$1N4578: LED23.2(DOUT) LED24.4(DIN)
$1N4586: LED22.2(DOUT) LED23.4(DIN)
$1N4742: LED25.2(DOUT) LED26.4(DIN)
$1N4750: LED24.2(DOUT) LED25.4(DIN)
$1N4906: LED27.2(DOUT) LED28.4(DIN)
$1N4914: LED26.2(DOUT) LED27.4(DIN)
$1N5070: LED29.2(DOUT) LED30.4(DIN)
$1N5078: LED28.2(DOUT) LED29.4(DIN)
$1N5242: LED30.2(DOUT) LED31.4(DIN)
$1N7595: LED48.2(DOUT) LED49.4(DIN)
$1N7599: LED47.2(DOUT) LED48.4(DIN)
$1N7611: LED45.2(DOUT) LED46.4(DIN)
$1N7615: LED46.2(DOUT) LED47.4(DIN)
$1N7625: LED44.2(DOUT) LED45.4(DIN)
$1N7631: LED43.2(DOUT) LED44.4(DIN)
$1N7637: LED42.2(DOUT) LED43.4(DIN)
$1N7643: LED41.2(DOUT) LED42.4(DIN)
$1N7657: LED35.2(DOUT) LED41.4(DIN)
$1N7665: LED34.2(DOUT) LED35.4(DIN)
$1N7671: LED32.2(DOUT) LED34.4(DIN)
$1N7677: LED36.4(DIN) LED38.2(DOUT)
$1N7685: LED32.4(DIN) LED36.2(DOUT)
$1N7695: LED33.2(DOUT) LED38.4(DIN)
$1N7703: LED33.4(DIN) LED39.2(DOUT)
$1N7711: LED37.4(DIN) LED40.2(DOUT)
$1N7717: LED37.2(DOUT) LED39.4(DIN)
$1N7729: LED50.2(DOUT) LED51.4(DIN)
$1N7739: LED49.2(DOUT) LED50.4(DIN)
$1N7747: LED53.2(DOUT) LED54.4(DIN)
$1N7755: LED52.2(DOUT) LED53.4(DIN)
$1N7763: LED51.2(DOUT) LED52.4(DIN)
$1N7769: LED54.2(DOUT) LED55.4(DIN)
$1N7781: LED56.2(DOUT) LED57.4(DIN)
$1N7787: LED55.2(DOUT) LED56.4(DIN)
$1N7793: LED59.2(DOUT) LED60.4(DIN)
$1N7801: LED58.2(DOUT) LED59.4(DIN)
$1N7807: LED57.2(DOUT) LED58.4(DIN)
$1N7815: LED61.2(DOUT) LED62.4(DIN)
$1N7827: LED60.2(DOUT) LED61.4(DIN)
$1N7841: LED62.2(DOUT) LED63.4(DIN)
$1N10228: LED80.2(DOUT) LED81.4(DIN)
$1N10232: LED79.2(DOUT) LED80.4(DIN)
$1N10244: LED77.2(DOUT) LED78.4(DIN)
$1N10248: LED78.2(DOUT) LED79.4(DIN)
$1N10258: LED76.2(DOUT) LED77.4(DIN)
$1N10264: LED75.2(DOUT) LED76.4(DIN)
$1N10270: LED74.2(DOUT) LED75.4(DIN)
$1N10276: LED73.2(DOUT) LED74.4(DIN)
$1N10290: LED67.2(DOUT) LED73.4(DIN)
$1N10298: LED66.2(DOUT) LED67.4(DIN)
$1N10304: LED64.2(DOUT) LED66.4(DIN)
$1N10310: LED68.4(DIN) LED70.2(DOUT)
$1N10318: LED64.4(DIN) LED68.2(DOUT)
$1N10328: LED65.2(DOUT) LED70.4(DIN)
$1N10336: LED65.4(DIN) LED71.2(DOUT)
$1N10344: LED69.4(DIN) LED72.2(DOUT)
$1N10350: LED69.2(DOUT) LED71.4(DIN)
$1N10362: LED82.2(DOUT) LED83.4(DIN)
$1N10372: LED81.2(DOUT) LED82.4(DIN)
$1N10380: LED85.2(DOUT) LED86.4(DIN)
$1N10388: LED84.2(DOUT) LED85.4(DIN)
$1N10396: LED83.2(DOUT) LED84.4(DIN)
$1N10402: LED86.2(DOUT) LED87.4(DIN)
$1N10414: LED88.2(DOUT) LED89.4(DIN)
$1N10420: LED87.2(DOUT) LED88.4(DIN)
$1N10426: LED91.2(DOUT) LED92.4(DIN)
$1N10434: LED90.2(DOUT) LED91.4(DIN)
$1N10440: LED89.2(DOUT) LED90.4(DIN)
$1N10448: LED93.2(DOUT) LED94.4(DIN)
$1N10460: LED92.2(DOUT) LED93.4(DIN)
$1N10474: LED94.2(DOUT) LED95.4(DIN)
$1N12861: LED112.2(DOUT) LED113.4(DIN)
$1N12865: LED111.2(DOUT) LED112.4(DIN)
$1N12877: LED109.2(DOUT) LED110.4(DIN)
$1N12881: LED110.2(DOUT) LED111.4(DIN)
$1N12891: LED108.2(DOUT) LED109.4(DIN)
$1N12897: LED107.2(DOUT) LED108.4(DIN)
$1N12903: LED106.2(DOUT) LED107.4(DIN)
$1N12909: LED105.2(DOUT) LED106.4(DIN)
$1N12923: LED99.2(DOUT) LED105.4(DIN)
$1N12931: LED98.2(DOUT) LED99.4(DIN)
$1N12937: LED96.2(DOUT) LED98.4(DIN)
$1N12943: LED100.4(DIN) LED102.2(DOUT)
$1N12951: LED96.4(DIN) LED100.2(DOUT)
$1N12961: LED97.2(DOUT) LED102.4(DIN)
$1N12969: LED97.4(DIN) LED103.2(DOUT)
$1N12977: LED101.4(DIN) LED104.2(DOUT)
$1N12983: LED101.2(DOUT) LED103.4(DIN)
$1N12995: LED114.2(DOUT) LED115.4(DIN)
$1N13005: LED113.2(DOUT) LED114.4(DIN)
$1N13013: LED117.2(DOUT) LED118.4(DIN)
$1N13021: LED116.2(DOUT) LED117.4(DIN)
$1N13029: LED115.2(DOUT) LED116.4(DIN)
$1N13035: LED118.2(DOUT) LED119.4(DIN)
$1N13047: LED120.2(DOUT) LED121.4(DIN)
$1N13053: LED119.2(DOUT) LED120.4(DIN)
$1N13059: LED123.2(DOUT) LED124.4(DIN)
$1N13067: LED122.2(DOUT) LED123.4(DIN)
$1N13073: LED121.2(DOUT) LED122.4(DIN)
$1N13081: LED125.2(DOUT) LED126.4(DIN)
$1N13093: LED124.2(DOUT) LED125.4(DIN)
$1N13107: LED126.2(DOUT) LED127.4(DIN)
$2N4691: LED180.2(DOUT) LED181.4(DIN)
$2N4697: LED182.2(DOUT) LED183.4(DIN)
$2N4705: LED181.2(DOUT) LED182.4(DIN)
$2N4715: LED160.4(DIN) LED164.2(DOUT)
$2N4723: LED164.4(DIN) LED166.2(DOUT)
$2N4735: LED161.2(DOUT) LED166.4(DIN)
$2N4741: LED177.2(DOUT) LED178.4(DIN)
$2N4745: LED179.2(DOUT) LED180.4(DIN)
$2N4753: LED178.2(DOUT) LED179.4(DIN)
$2N4765: LED176.2(DOUT) LED177.4(DIN)
$2N4769: LED171.2(DOUT) LED172.4(DIN)
$2N4773: LED173.2(DOUT) LED174.4(DIN)
$2N4781: LED175.2(DOUT) LED176.4(DIN)
$2N4787: LED174.2(DOUT) LED175.4(DIN)
$2N4799: LED172.2(DOUT) LED173.4(DIN)
$2N4811: LED170.2(DOUT) LED171.4(DIN)
$2N4819: LED169.2(DOUT) LED170.4(DIN)
$2N4827: LED163.2(DOUT) LED169.4(DIN)
$2N4837: LED162.2(DOUT) LED163.4(DIN)
$2N4845: LED160.2(DOUT) LED162.4(DIN)
$2N4849: LED161.4(DIN) LED167.2(DOUT)
$2N4855: LED165.2(DOUT) LED167.4(DIN)
$2N4863: LED165.4(DIN) LED168.2(DOUT)
$2N4877: LED190.2(DOUT) LED191.4(DIN)
$2N4883: LED189.2(DOUT) LED190.4(DIN)
$2N4889: LED188.2(DOUT) LED189.4(DIN)
$2N4893: LED157.2(DOUT) LED158.4(DIN)
$2N4901: LED158.2(DOUT) LED159.4(DIN)
$2N4911: LED156.2(DOUT) LED157.4(DIN)
$2N4917: LED155.2(DOUT) LED156.4(DIN)
$2N4933: LED187.2(DOUT) LED188.4(DIN)
$2N4939: LED186.2(DOUT) LED187.4(DIN)
$2N4949: LED183.2(DOUT) LED184.4(DIN)
$2N4953: LED185.2(DOUT) LED186.4(DIN)
$2N4965: LED184.2(DOUT) LED185.4(DIN)
$2N4971: LED151.2(DOUT) LED152.4(DIN)
$2N4977: LED152.2(DOUT) LED153.4(DIN)
$2N4981: LED153.2(DOUT) LED154.4(DIN)
$2N4989: LED150.2(DOUT) LED151.4(DIN)
$2N4993: LED149.2(DOUT) LED150.4(DIN)
$2N4999: LED154.2(DOUT) LED155.4(DIN)
$2N5019: LED148.2(DOUT) LED149.4(DIN)
$2N5027: LED147.2(DOUT) LED148.4(DIN)
$2N5035: LED146.2(DOUT) LED147.4(DIN)
$2N5039: LED145.2(DOUT) LED146.4(DIN)
$2N5061: LED133.2(DOUT) LED135.4(DIN)
$2N5067: LED132.4(DIN) LED134.2(DOUT)
$2N5073: LED129.2(DOUT) LED134.4(DIN)
$2N5079: LED128.4(DIN) LED132.2(DOUT)
$2N5085: LED137.2(DOUT) LED138.4(DIN)
$2N5089: LED131.2(DOUT) LED137.4(DIN)
$2N5093: LED130.2(DOUT) LED131.4(DIN)
$2N5097: LED128.2(DOUT) LED130.4(DIN)
$2N5101: LED129.4(DIN) LED135.2(DOUT)
$2N5113: LED133.4(DIN) LED136.2(DOUT)
$2N5133: LED139.2(DOUT) LED140.4(DIN)
$2N5141: LED138.2(DOUT) LED139.4(DIN)
$2N5159: LED141.2(DOUT) LED142.4(DIN)
$2N5165: LED140.2(DOUT) LED141.4(DIN)
$2N5177: LED142.2(DOUT) LED143.4(DIN)
$2N5185: LED143.2(DOUT) LED144.4(DIN)
$2N5189: LED144.2(DOUT) LED145.4(DIN)
$2N15223: LED244.2(DOUT) LED245.4(DIN)
$2N15229: LED246.2(DOUT) LED247.4(DIN)
$2N15237: LED245.2(DOUT) LED246.4(DIN)
$2N15247: LED224.4(DIN) LED228.2(DOUT)
$2N15255: LED228.4(DIN) LED230.2(DOUT)
$2N15267: LED225.2(DOUT) LED230.4(DIN)
$2N15273: LED241.2(DOUT) LED242.4(DIN)
$2N15277: LED243.2(DOUT) LED244.4(DIN)
$2N15285: LED242.2(DOUT) LED243.4(DIN)
$2N15297: LED240.2(DOUT) LED241.4(DIN)
$2N15301: LED235.2(DOUT) LED236.4(DIN)
$2N15305: LED237.2(DOUT) LED238.4(DIN)
$2N15313: LED239.2(DOUT) LED240.4(DIN)
$2N15319: LED238.2(DOUT) LED239.4(DIN)
$2N15331: LED236.2(DOUT) LED237.4(DIN)
$2N15343: LED234.2(DOUT) LED235.4(DIN)
$2N15351: LED233.2(DOUT) LED234.4(DIN)
$2N15359: LED227.2(DOUT) LED233.4(DIN)
$2N15369: LED226.2(DOUT) LED227.4(DIN)
$2N15377: LED224.2(DOUT) LED226.4(DIN)
$2N15381: LED225.4(DIN) LED231.2(DOUT)
$2N15387: LED229.2(DOUT) LED231.4(DIN)
$2N15395: LED229.4(DIN) LED232.2(DOUT)
$2N15409: LED254.2(DOUT) LED255.4(DIN)
$2N15415: LED253.2(DOUT) LED254.4(DIN)
$2N15421: LED252.2(DOUT) LED253.4(DIN)
$2N15425: LED221.2(DOUT) LED222.4(DIN)
$2N15433: LED222.2(DOUT) LED223.4(DIN)
$2N15443: LED220.2(DOUT) LED221.4(DIN)
$2N15449: LED219.2(DOUT) LED220.4(DIN)
$2N15465: LED251.2(DOUT) LED252.4(DIN)
$2N15471: LED250.2(DOUT) LED251.4(DIN)
$2N15481: LED247.2(DOUT) LED248.4(DIN)
$2N15485: LED249.2(DOUT) LED250.4(DIN)
$2N15497: LED248.2(DOUT) LED249.4(DIN)
$2N15503: LED215.2(DOUT) LED216.4(DIN)
$2N15509: LED216.2(DOUT) LED217.4(DIN)
$2N15513: LED217.2(DOUT) LED218.4(DIN)
$2N15521: LED214.2(DOUT) LED215.4(DIN)
$2N15525: LED213.2(DOUT) LED214.4(DIN)
$2N15531: LED218.2(DOUT) LED219.4(DIN)
$2N15551: LED212.2(DOUT) LED213.4(DIN)
$2N15559: LED211.2(DOUT) LED212.4(DIN)
$2N15567: LED210.2(DOUT) LED211.4(DIN)
$2N15571: LED209.2(DOUT) LED210.4(DIN)
$2N15593: LED197.2(DOUT) LED199.4(DIN)
$2N15599: LED196.4(DIN) LED198.2(DOUT)
$2N15605: LED193.2(DOUT) LED198.4(DIN)
$2N15611: LED192.4(DIN) LED196.2(DOUT)
$2N15617: LED201.2(DOUT) LED202.4(DIN)
$2N15621: LED195.2(DOUT) LED201.4(DIN)
$2N15625: LED194.2(DOUT) LED195.4(DIN)
$2N15629: LED192.2(DOUT) LED194.4(DIN)
$2N15633: LED193.4(DIN) LED199.2(DOUT)
$2N15645: LED197.4(DIN) LED200.2(DOUT)
$2N15665: LED203.2(DOUT) LED204.4(DIN)
$2N15673: LED202.2(DOUT) LED203.4(DIN)
$2N15691: LED205.2(DOUT) LED206.4(DIN)
$2N15697: LED204.2(DOUT) LED205.4(DIN)
$2N15709: LED206.2(DOUT) LED207.4(DIN)
$2N15717: LED207.2(DOUT) LED208.4(DIN)
$2N15721: LED208.2(DOUT) LED209.4(DIN)
$3N534: R2.1 U2.3(1Y)

Not connected (* = marked no-connect by the designer): U2 6(2Y)* 8(3Y)* 11(4Y)*
